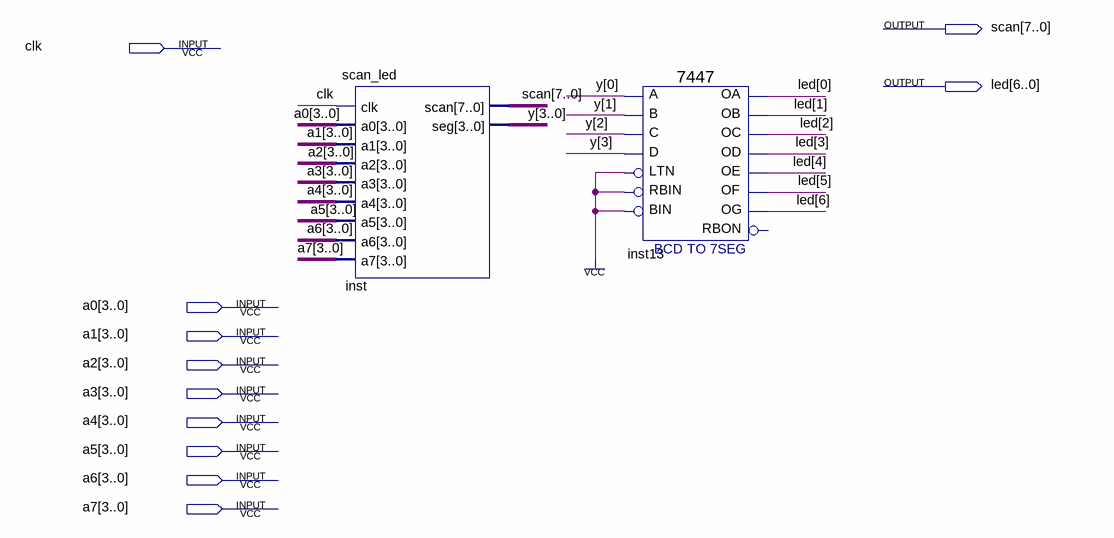
[diagram p0: schematic sheet]
// Quartus schematic xianshi.bdf as structural Verilog: 2 symbols, 11 pins
module xianshi (
  input  clk,
  input  [3:0] a0,
  input  [3:0] a1,
  input  [3:0] a2,
  input  [3:0] a3,
  input  [3:0] a4,
  input  [3:0] a5,
  input  [3:0] a6,
  input  [3:0] a7,
  output [7:0] scan,
  output [6:0] led
);

  wire [3:0] y;

  scan_led inst (
    .clk(clk), .a0(a0), .a1(a1), .a2(a2), .a3(a3), .a4(a4), .a5(a5), .a6(a6), .a7(a7), .scan(scan), .seg(y));
  \7447  inst13 (
    .LTN(1'b1), .B(y[1]), .C(y[2]), .D(y[3]), .RBIN(1'b1), .BIN(1'b1), .A(y[0]), .OB(led[1]), .OC(led[2]),
    .OE(led[4]), .OD(led[3]), .OF(led[5]), .OG(led[6]), .OA(led[0]));  // open: RBON
endmodule
